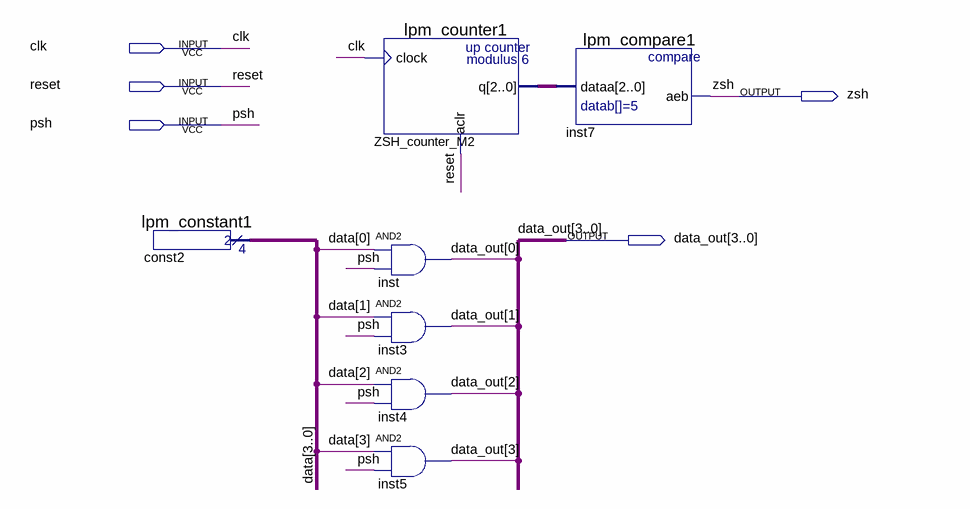
[diagram p0: schematic sheet]
// Quartus schematic master2.bdf as structural Verilog: 7 symbols, 5 pins
module master2 (
  input  clk,
  input  reset,
  input  psh,
  output zsh,
  output [3:0] data_out
);

  wire [2:0] ZSH_counter_M2_q;
  wire [3:0] data;

  lpm_constant1 const2 (.result(data));
  lpm_counter1 ZSH_counter_M2 (.clock(clk), .aclr(reset), .q(ZSH_counter_M2_q));
  and inst (data_out[0], data[0], psh);
  and inst3 (data_out[1], data[1], psh);
  and inst4 (data_out[2], data[2], psh);
  and inst5 (data_out[3], data[3], psh);
  lpm_compare1 inst7 (.dataa(ZSH_counter_M2_q), .aeb(zsh));
endmodule
